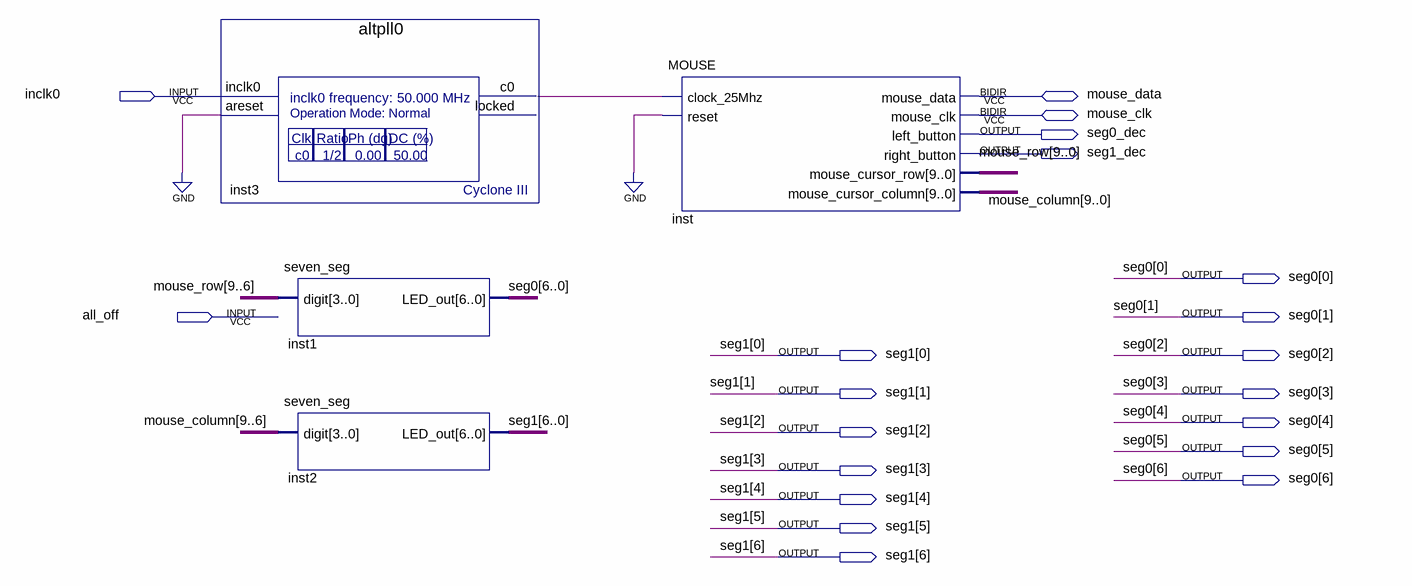
[diagram p0: schematic sheet]
// Quartus schematic MouseExample.bdf as structural Verilog: 4 symbols, 20 pins
module MouseExample (
  input  inclk0,
  input  all_off,
  inout  mouse_data,
  inout  mouse_clk,
  output seg0_dec,
  output seg1_dec,
  output [6:0] seg0,
  output [6:0] seg1
);

  wire inst3_c0;
  wire [9:0] mouse_column, mouse_row;

  altpll0 inst3 (.inclk0(inclk0), .areset(1'b0), .c0(inst3_c0));  // open: locked
  seven_seg inst1 (.digit(mouse_row[9:6]), .LED_out(seg0));
  seven_seg inst2 (.digit(mouse_column[9:6]), .LED_out(seg1));
  MOUSE inst (
    .clock_25Mhz(inst3_c0), .reset(1'b0), .left_button(seg0_dec), .right_button(seg1_dec),
    .mouse_cursor_row(mouse_row), .mouse_cursor_column(mouse_column), .mouse_data(mouse_data),
    .mouse_clk(mouse_clk));
endmodule
